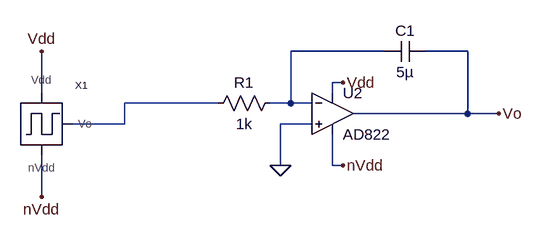
[diagram p0: schematic trianglewavegenerator.asc]
trianglewavegenerator.asc, the LTspice schematic file:
Version 4
SHEET 1 1252 680
WIRE 704 48 560 48
WIRE 832 48 768 48
WIRE 640 96 624 96
WIRE 176 112 176 48
WIRE 624 112 624 96
WIRE 448 128 304 128
WIRE 560 128 560 48
WIRE 560 128 528 128
WIRE 592 128 560 128
WIRE 832 144 832 48
WIRE 832 144 656 144
WIRE 880 144 832 144
WIRE 304 160 304 128
WIRE 304 160 224 160
WIRE 592 160 544 160
WIRE 544 224 544 160
WIRE 624 224 624 176
WIRE 640 224 624 224
WIRE 176 272 176 208
FLAG 176 48 Vdd
FLAG 176 272 nVdd
FLAG 544 224 0
FLAG 640 224 nVdd
FLAG 640 96 Vdd
FLAG 880 144 Vo
SYMBOL squarewavegenerator 176 160 R0
SYMATTR InstName X1
SYMBOL res 544 112 R90
WINDOW 0 0 56 VBottom 2
WINDOW 3 32 56 VTop 2
SYMATTR InstName R1
SYMATTR Value 1k
SYMBOL cap 768 32 R90
WINDOW 0 0 32 VBottom 2
WINDOW 3 32 32 VTop 2
SYMATTR InstName C1
SYMATTR Value 5µ
SYMBOL OpAmps\\AD822 624 80 R0
SYMATTR InstName U2

The netlist it stands for:
* trianglewavegenerator.asc
XX1 Vdd nVdd N002 squarewavegenerator  ; pins Vdd nVdd Vo
R1 N001 N002 1k
C1 Vo N001 5µ
XU2 0 N001 Vdd nVdd Vo AD822  ; pins In+ In- V+ V- OUT
.backanno
.end